# EAGLE schematic OpenModem_Schematic (EAGLE 9.2.2)
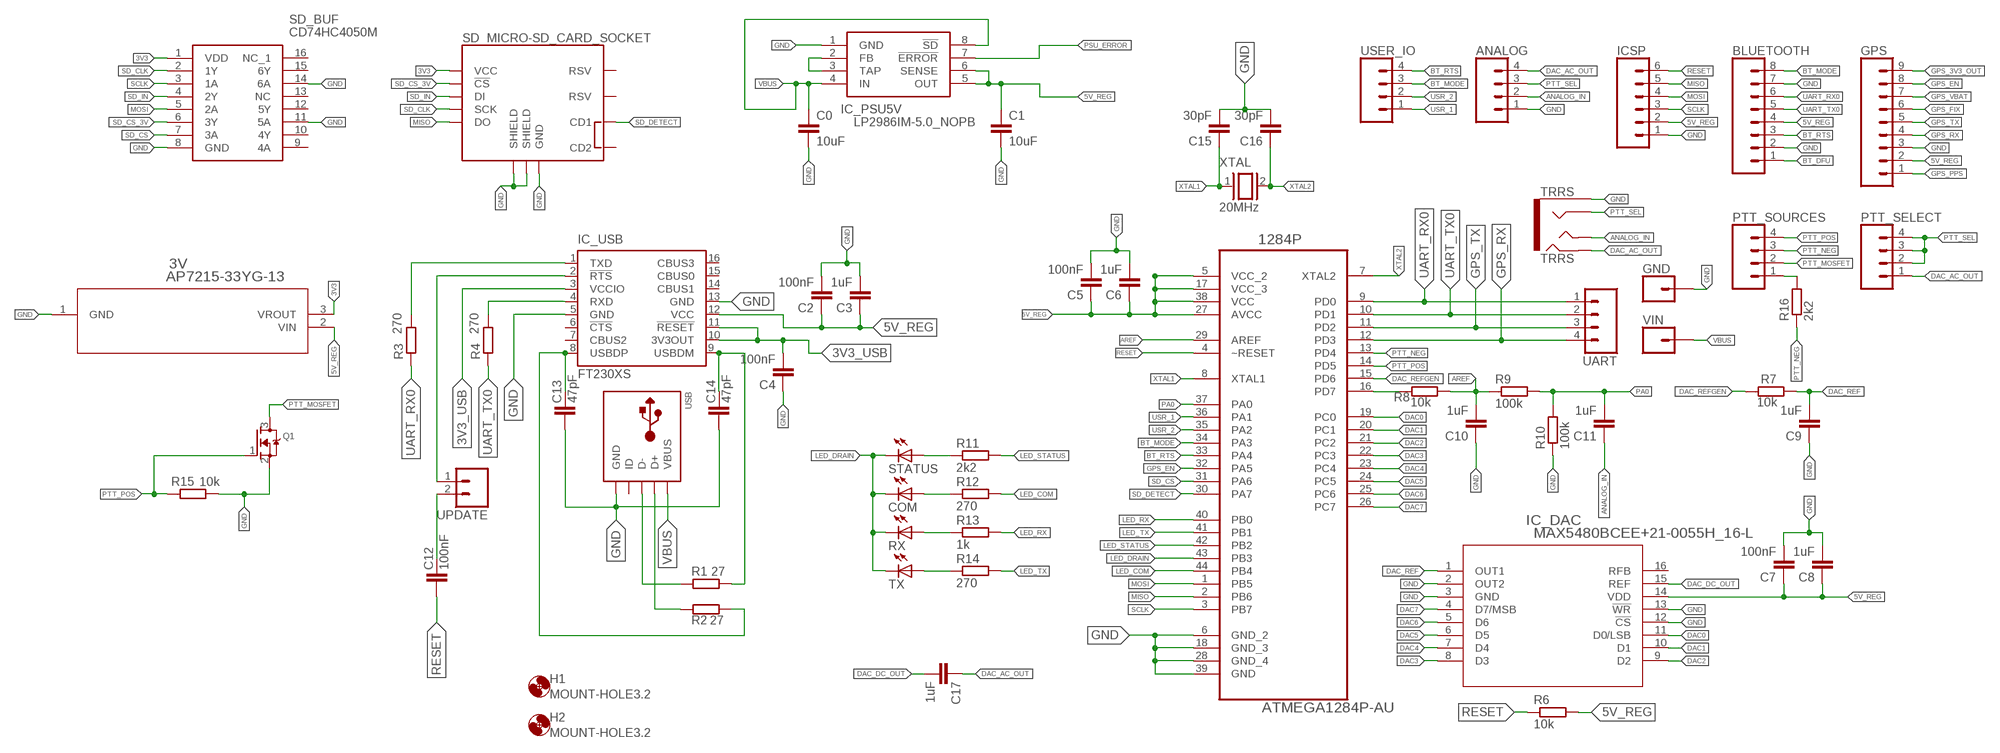
[diagram p0: schematic, sheet 1]

## Parts
3V  AP7215-33YG-13  [SOT89-3L]
1284P  ATMEGA1284P-AU  [QFP80P1200X1200X120-44N]
ANALOG  CONN_04  [1X04]
BLUETOOTH  CONN_08"  [1X08]
C0  10uF  C-EUC0805  [C0805]
C1  10uF  C-EUC0805  [C0805]
C2  100nF  C-EUC0603  [C0603]
C3  1uF  C-EUC0603  [C0603]
C4  100nF  C-EUC0603  [C0603]
C5  100nF  C-EUC0603  [C0603]
C6  1uF  C-EUC0603  [C0603]
C7  100nF  C-EUC0603  [C0603]
C8  1uF  C-EUC0603  [C0603]
C9  1uF  C-EUC0603  [C0603]
C10  1uF  C-EUC0603  [C0603]
C11  1uF  C-EUC0603  [C0603]
C12  100nF  C-EUC0603  [C0603]
C13  47pF  C-EUC0603  [C0603]
C14  47pF  C-EUC0603  [C0603]
C15  30pF  C-EUC0603  [C0603]
C16  30pF  C-EUC0603  [C0603]
C17  1uF  C-EUC0603  [C0603]
COM  LEDCHIP-LED0603  [CHIP-LED0603]
GND  CONN_01  [1X01]
GPS  CONN_09  [1X09]
H1  MOUNT-HOLE3.2  [3,2]
H2  MOUNT-HOLE3.2  [3,2]
IC_DAC  MAX5480BCEE+21-0055H_16-L  [21-0055H_16-L]
IC_PSU5V  LP2986IM-5.0_NOPB  [SOIC127P600X175-8N]
IC_USB  FT230XS  [SSOP16]
ICSP  CONN_06SILK_FEMALE_PTH  [1X06]
PTT_SELECT  CONN_04  [1X04]
PTT_SOURCES  CONN_04  [1X04]
Q1  MOSFET-NSMALLER  [SOT23-SMALLER]
R1  27  R-EU_R0603  [R0603]
R2  27  R-EU_R0603  [R0603]
R3  270  R-EU_R0603  [R0603]
R4  270  R-EU_R0603  [R0603]
R6  10k  R-EU_R0603  [R0603]
R7  10k  R-EU_R0603  [R0603]
R8  10k  R-EU_R0603  [R0603]
R9  100k  R-EU_R0603  [R0603]
R10  100k  R-EU_R0603  [R0603]
R11  2k2  R-EU_R0603  [R0603]
R12  270  R-EU_R0603  [R0603]
R13  1k  R-EU_R0603  [R0603]
R14  270  R-EU_R0603  [R0603]
R15  10k  R-EU_R0603  [R0603]
R16  2k2  R-EU_R0603  [R0603]
RX  LEDCHIP-LED0603  [CHIP-LED0603]
SD  MICRO-SD_CARD_SOCKET  [MICRO-SD-SOCKET]
SD_BUF  CD74HC4050M  [SOIC127P600X175-16N]
STATUS  LEDCHIP-LED0603  [CHIP-LED0603]
TRRS  TRRS  AUDIO_JACK_TRRSSMD_RA  [AUDIO_JACK_3.5MM_TRRS_SMD_RA]
TX  LEDCHIP-LED0603  [CHIP-LED0603]
UART  M04PTH  [1X04]
UPDATE  M02PTH  [1X02]
USB  USBMOLEX  [USB-MINIB-THM-MOLEX]
USER_IO  CONN_04  [1X04]
VIN  CONN_01  [1X01]
XTAL  20MHz  XTAL/S  [QS]

## Nets
3V3: 3V.3(VROUT) SD.VCC SD_BUF.1(VDD)
3V3_USB: C4.2 IC_USB.3(VCCIO) IC_USB.10(3V3OUT) IC_USB.11(!RESET)
5V_REG: 3V.2(VIN) 1284P.5(VCC_2) 1284P.17(VCC_3) 1284P.27(AVCC) 1284P.38(VCC) BLUETOOTH.4 C1.1 C2.1 C3.1 C5.1 C6.1 C7.1 C8.1 GPS.2 IC_DAC.14(VDD) IC_PSU5V.5(OUT) IC_PSU5V.6(SENSE) IC_USB.12(VCC) ICSP.2 R6.2
ADC_REFGEN: 1284P.16(PD7) R8.1
ANALOG_IN: ANALOG.2 C11.1 TRRS.TIP
AREF: 1284P.29(AREF) C10.2 R8.2 R9.1
BT_DFU: BLUETOOTH.1
BT_MODE: 1284P.34(PA3) BLUETOOTH.8 USER_IO.3
BT_RTS: 1284P.33(PA4) BLUETOOTH.3 USER_IO.4
DAC0: 1284P.19(PC0) IC_DAC.11(D0/LSB)
DAC1: 1284P.20(PC1) IC_DAC.10(D1)
DAC2: 1284P.21(PC2) IC_DAC.9(D2)
DAC3: 1284P.22(PC3) IC_DAC.8(D3)
DAC4: 1284P.23(PC4) IC_DAC.7(D4)
DAC5: 1284P.24(PC5) IC_DAC.6(D5)
DAC6: 1284P.25(PC6) IC_DAC.5(D6)
DAC7: 1284P.26(PC7) IC_DAC.4(D7/MSB)
DAC_AC_OUT: ANALOG.4 C17.1 PTT_SELECT.1 TRRS.RING2
DAC_DC_OUT: C17.2 IC_DAC.15(REF)
DAC_REF: C9.2 IC_DAC.1(OUT1) R7.2
DAC_REFGEN: 1284P.15(PD6) R7.1
EXT_RESET: C12.2 UPDATE.2
GND: 3V.1(GND) 1284P.6(GND_2) 1284P.18(GND_3) 1284P.28(GND_4) 1284P.39(GND) ANALOG.1 BLUETOOTH.2 BLUETOOTH.7 C0.2 C1.2 C2.2 C3.2 C4.1 C5.2 C6.2 C7.2 C8.2 C9.1 C10.1 C13.1 C14.1 C15.2 C16.2 GND.1 GPS.3 IC_DAC.2(OUT2) IC_DAC.3(GND) IC_DAC.12(!CS) IC_DAC.13(!WR) IC_PSU5V.1(GND) IC_USB.5(GND) IC_USB.13(GND) ICSP.1 Q1.2(S) R10.1 R15.1 SD.GND SD.GND1(SHIELD) SD.GND3(SHIELD) SD_BUF.8(GND) SD_BUF.11(5A) SD_BUF.14(6A) TRRS.EARTH USB.GND
GPS_3V3_OUT: GPS.9
GPS_EN: 1284P.32(PA5) GPS.8
GPS_FIX: GPS.6
GPS_PPS: GPS.1
GPS_RX: 1284P.12(PD3) GPS.4 UART.4
GPS_TX: 1284P.11(PD2) GPS.5 UART.3
GPS_VBAT: GPS.7
LED_COM: 1284P.44(PB4) R12.2
LED_DRAIN: 1284P.43(PB3) COM.C RX.C STATUS.C TX.C
LED_RX: 1284P.40(PB0) R13.2
LED_STATUS: 1284P.42(PB2) R11.2
LED_TX: 1284P.41(PB1) R14.2
MISO: 1284P.2(PB6) ICSP.5 SD.DO
MOSI: 1284P.1(PB5) ICSP.4 SD_BUF.5(2A)
N$5: R11.1 STATUS.A
N$7: COM.A R12.1
N$8: R13.1 RX.A
N$9: R14.1 TX.A
PA0: 1284P.37(PA0) C11.2 R9.2 R10.2
PSU_ERROR: IC_PSU5V.7(!ERROR)
PSU_FEEDBACK: IC_PSU5V.2(FB) IC_PSU5V.3(TAP)
PTT_MOSFET: PTT_SOURCES.2 Q1.3(D)
PTT_NEG: 1284P.13(PD4) PTT_SOURCES.3 R16.1
PTT_NEG_RES: PTT_SOURCES.1 R16.2
PTT_POS: 1284P.14(PD5) PTT_SOURCES.4 Q1.1(G) R15.2
PTT_SEL: ANALOG.3 PTT_SELECT.2 PTT_SELECT.3 PTT_SELECT.4 TRRS.RING1
RESET: 1284P.4(~RESET) C12.1 ICSP.6 R6.1
SCLK: 1284P.3(PB7) ICSP.3 SD_BUF.3(1A)
SD_CLK: SD.SCLK(SCK) SD_BUF.2(1Y)
SD_CS: 1284P.31(PA6) SD_BUF.7(3A)
SD_CS_3V: SD.CS(!CS) SD_BUF.6(3Y)
SD_DETECT: 1284P.30(PA7) SD.CD1
SD_IN: SD.DI SD_BUF.4(2Y)
UART_RX0: 1284P.9(PD0) BLUETOOTH.6 R3.1 UART.1
UART_TX0: 1284P.10(PD1) BLUETOOTH.5 R4.1 UART.2
USB_DM: C14.2 IC_USB.9(USBDM) R1.1
USB_DM_IN: R1.2 USB.D-
USB_DP: C13.2 IC_USB.8(USBDP) R2.1
USB_DP_IN: R2.2 USB.D+
USB_RTS: IC_USB.2(!RTS) UPDATE.1
USB_UART_RX: IC_USB.4(RXD) R4.2
USB_UART_TX: IC_USB.1(TXD) R3.2
USR_1: 1284P.36(PA1) USER_IO.1
USR_2: 1284P.35(PA2) USER_IO.2
VBUS: C0.1 IC_PSU5V.4(IN) IC_PSU5V.8(!SD) USB.VBUS VIN.1
XTAL1: 1284P.8(XTAL1) C15.1 XTAL.1
XTAL2: 1284P.7(XTAL2) C16.1 XTAL.2
Unconnected: IC_DAC.16(RFB) IC_USB.6(!CTS) IC_USB.7(CBUS2) IC_USB.14(CBUS1) IC_USB.15(CBUS0) IC_USB.16(CBUS3) SD.CD2 SD.RSV1(RSV) SD.RSV2(RSV) SD_BUF.9(4A) SD_BUF.10(4Y) SD_BUF.12(5Y) SD_BUF.13(NC) SD_BUF.15(6Y) SD_BUF.16(NC_1) USB.ID

## Library data of the parts
3V = AP7215-33YG:AP7215-33YG-13; MANUFACTURER_PART_NUMBER: AP721533YG13; VENDOR: Diodes Inc
1284P = Atmel_By_element14_Batch_1-00:ATMEGA1284P-AU: Microcontroller with Programmable Flash; MPN: ATMEGA1284P-AU; OC_FARNELL: 1715480; OC_NEWARK: 15R0263; PACKAGE: TQFP-44; SUPPLIER: Atmel
ANALOG PTT_SELECT PTT_SOURCES USER_IO = SparkFun-Connectors:CONN_04: Multi connection point. Often used as Generic Header-pin footprint for 0.1 inch spaced/style header connections On any of the 0.1 inch spaced packages, you can populate with these: Break Away Headers - Straight <https://www.sparkfun.com/products/116> (PRT-00116) Break Away Male Headers - Right Angle <https://www.sparkfun.com/products/553> (PRT-00553) Female Headers <https://www.sparkfun.com/products/115> (PRT-00115) Break Away Headers - Machine Pin <https://www.sparkfun.com/products/117> (PRT-00117) Break Away Female Headers - Swiss Machine Pin <https://www.sparkfun.com/products/743> (PRT-00743) For SCREWTERMINALS and SPRING TERMINALS visit here: Screw Terimnals on SparkFun.com <https://www.sparkfun.com/search/results?term=Screw+Terminals> (5mm/3.5mm/2.54mm spacing) This device is also useful as a general connection point to wire up your design to another part of your project. Our various solder wires solder well into these plated through hole pads. Hook-Up Wire - Assortment (Stranded, 22 AWG) <https://www.sparkfun.com/products/11375> (PRT-11375) Hook-Up Wire - Assortment (Solid Core, 22 AWG) <https://www.sparkfun.com/products/11367> (PRT-11367) View the entire wire category on our website here <https://www.sparkfun.com/categories/141> Special notes: Molex polarized connector foot print use with SKU : PRT-08231 with associated crimp pins and housings. 1MM SMD Version SKU: PRT-10208; PROD_ID: CONN-09696
BLUETOOTH = SparkFun-Connectors:CONN_08: Multi connection point. Often used as Generic Header-pin footprint for 0.1 inch spaced/style header connections On any of the 0.1 inch spaced packages, you can populate with these: Break Away Headers - Straight <https://www.sparkfun.com/products/116> (PRT-00116) Break Away Male Headers - Right Angle <https://www.sparkfun.com/products/553> (PRT-00553) Female Headers <https://www.sparkfun.com/products/115> (PRT-00115) Break Away Headers - Machine Pin <https://www.sparkfun.com/products/117> (PRT-00117) Break Away Female Headers - Swiss Machine Pin <https://www.sparkfun.com/products/743> (PRT-00743) Arduino Stackable Header - 8 Pin <https://www.sparkfun.com/products/9279> (PRT-09279) For SCREWTERMINALS and SPRING TERMINALS visit here: Screw Terimnals on SparkFun.com <https://www.sparkfun.com/search/results?term=Screw+Terminals> (5mm/3.5mm/2.54mm spacing) This device is also useful as a general connection point to wire up your design to another part of your project. Our various solder wires solder well into these plated through hole pads. Hook-Up Wire - Assortment (Stranded, 22 AWG) <https://www.sparkfun.com/products/11375> (PRT-11375) Hook-Up Wire - Assortment (Solid Core, 22 AWG) <https://www.sparkfun.com/products/11367> (PRT-11367) View the entire wire category on our website here <https://www.sparkfun.com/categories/141> Special notes: Molex polarized connector foot print use with SKU : PRT-08231 with associated crimp pins and housings. 1MM SMD Version SKU: PRT-10208 NOTES ON THE VARIANTS LOCK and LOCK_LONGPADS... This footprint was designed to help hold the alignment of a through-hole component (i.e. 6-pin header) while soldering it into place. You may notice that each hole has been shifted either up or down by 0.005 of an inch from it's more standard position (which is a perfectly straight line). This slight alteration caused the pins (the squares in the middle) to touch the edges of the holes. Because they are alternating, it causes a "brace" to hold the component in place. 0.005 has proven to be the perfect amount of "off-center" position when using our standard breakaway headers. Although looks a little odd when you look at the bare footprint, once you have a header in there, the alteration is very hard to notice. Also,if you push a header all the way into place, it is covered up entirely on the bottom side.; PROD_ID: CONN-08438
C0 C1-C17 = rcl:C-EU: CAPACITOR, European symbol
COM RX STATUS TX = adafruit:LED: LED OSRAM: - CHIPLED LG R971, LG N971, LY N971, LG Q971, LY Q971, LO R971, LY R971 LH N974, LH R974 LS Q976, LO Q976, LY Q976 LO Q996 - Hyper CHIPLED LW Q18S LB Q993, LB Q99A, LB R99A - SideLED LS A670, LO A670, LY A670, LG A670, LP A670 LB A673, LV A673, LT A673, LW A673 LH A674 LY A675 LS A676, LA A676, LO A676, LY A676, LW A676 LS A679, LY A679, LG A679 - Hyper Micro SIDELED® LS Y876, LA Y876, LO Y876, LY Y876 LT Y87S - SmartLED LW L88C, LW L88S LB L89C, LB L89S, LG L890 LS L89K, LO L89K, LY L89K LS L896, LA L896, LO L896, LY L896 - TOPLED LS T670, LO T670, LY T670, LG T670, LP T670 LSG T670, LSP T670, LSY T670, LOP T670, LYG T670 LG T671, LOG T671, LSG T671 LB T673, LV T673, LT T673, LW T673 LH T674 LS T676, LA T676, LO T676, LY T676, LB T676, LH T676, LSB T676, LW T676 LB T67C, LV T67C, LT T67C, LS T67K, LO T67K, LY T67K, LW E67C LS E67B, LA E67B, LO E67B, LY E67B, LB E67C, LV E67C, LT E67C LW T67C LS T679, LY T679, LG T679 LS T770, LO T770, LY T770, LG T770, LP T770 LB T773, LV T773, LT T773, LW T773 LH T774 LS E675, LA E675, LY E675, LS T675 LS T776, LA T776, LO T776, LY T776, LB T776 LHGB T686 LT T68C, LB T68C - Hyper Mini TOPLED® LB M676 - Mini TOPLED Santana® LG M470 LS M47K, LO M47K, LY M47K Source: http://www.osram.convergy.de/
GND VIN = SparkFun-Connectors:CONN_01: Single connection point. Often used as Generic Header-pin footprint for 0.1 inch spaced/style header connections On any of the 0.1 inch spaced packages, you can populate with these: Break Away Headers - Straight <https://www.sparkfun.com/products/116> (PRT-00116) Break Away Male Headers - Right Angle <https://www.sparkfun.com/products/553> (PRT-00553) Female Headers <https://www.sparkfun.com/products/115> (PRT-00115) Break Away Headers - Machine Pin <https://www.sparkfun.com/products/117> (PRT-00117) Break Away Female Headers - Swiss Machine Pin <https://www.sparkfun.com/products/743> (PRT-00743) This device is also useful as a general connection point to wire up your design to another part of your project. Our various solder wires solder well into these plated through hole pads. Hook-Up Wire - Assortment (Stranded, 22 AWG) <https://www.sparkfun.com/products/11375> (PRT-11375) Hook-Up Wire - Assortment (Solid Core, 22 AWG) <https://www.sparkfun.com/products/11367> (PRT-11367) View the entire wire category on our website here <https://www.sparkfun.com/categories/141> Special notes: SMTSO-256-ET is a "flush mount" nut for a 4-40 screw. We mostly use this on specialty testbeds; it is a nice way to connect hardware to your PCB at an adjustable hieght. Also note, the SNAP packages are for using a snappable style connector. We sell a baggie of snaps and they are also used on two LilyPad designs: Snap Assortment - 30 pack (male and female) <https://www.sparkfun.com/products/11347> (DEV-11347) LilyPad Arduino SimpleSnap <https://www.sparkfun.com/products/10941> (DEV-10941) LilyPad SimpleSnap Protoboard <https://www.sparkfun.com/products/10940> (DEV-10940)
GPS = SparkFun-Connectors:CONN_09: Multi connection point. Often used as Generic Header-pin footprint for 0.1 inch spaced/style header connections On any of the 0.1 inch spaced packages, you can populate with these: Break Away Headers - Straight <https://www.sparkfun.com/products/116> (PRT-00116) Break Away Male Headers - Right Angle <https://www.sparkfun.com/products/553> (PRT-00553) Female Headers <https://www.sparkfun.com/products/115> (PRT-00115) Break Away Headers - Machine Pin <https://www.sparkfun.com/products/117> (PRT-00117) Break Away Female Headers - Swiss Machine Pin <https://www.sparkfun.com/products/743> (PRT-00743) For SCREWTERMINALS and SPRING TERMINALS visit here: Screw Terimnals on SparkFun.com <https://www.sparkfun.com/search/results?term=Screw+Terminals> (5mm/3.5mm/2.54mm spacing) This device is also useful as a general connection point to wire up your design to another part of your project. Our various solder wires solder well into these plated through hole pads. Hook-Up Wire - Assortment (Stranded, 22 AWG) <https://www.sparkfun.com/products/11375> (PRT-11375) Hook-Up Wire - Assortment (Solid Core, 22 AWG) <https://www.sparkfun.com/products/11367> (PRT-11367) View the entire wire category on our website here <https://www.sparkfun.com/categories/141> Special notes: Molex polarized connector foot print use with SKU : PRT-08231 with associated crimp pins and housings. 1MM SMD Version SKU: PRT-10208 NOTES ON THE VARIANTS LOCK and LOCK_LONGPADS... This footprint was designed to help hold the alignment of a through-hole component (i.e. 6-pin header) while soldering it into place. You may notice that each hole has been shifted either up or down by 0.005 of an inch from it's more standard position (which is a perfectly straight line). This slight alteration caused the pins (the squares in the middle) to touch the edges of the holes. Because they are alternating, it causes a "brace" to hold the component in place. 0.005 has proven to be the perfect amount of "off-center" position when using our standard breakaway headers. Although looks a little odd when you look at the bare footprint, once you have a header in there, the alteration is very hard to notice. Also,if you push a header all the way into place, it is covered up entirely on the bottom side.
H1 H2 = holes:MOUNT-HOLE: MOUNTING HOLE with drill center marker
IC_DAC = MAX5480:MAX5480BCEE+; MANUFACTURER_PART_NUMBER: MAX5480BCEE+; VENDOR: Maxim Integrated Products
IC_PSU5V = SamacSys_Parts:LP2986IM-5.0_NOPB: Micropower, 200 mA Ultra Low-Dropout Fixed or Adjustable Voltage Regulator Source: Datasheet <http://www.ti.com/lit/ds/symlink/lp2986.pdf>; DESCRIPTION: Micropower, 200 mA Ultra Low-Dropout Fixed or Adjustable Voltage Regulator; HEIGHT: 1.75mm; MANUFACTURER_NAME: Texas Instruments; MANUFACTURER_PART_NUMBER: LP2986IM-5.0/NOPB; MOUSER_PART_NUMBER: 926-2986IM-5.0/NOPB
IC_USB = ftdichip:FT230X: USB to BASIC UART IC Auto generated by make-symbol-device-package-bsdl.ulp Rev. 43 Source: Data sheet <http://www.ftdichip.com/Support/Documents/DataSheets/ICs/DS_FT230X.pdf>
ICSP = SparkFun-Connectors:CONN_06: Multi connection point. Often used as Generic Header-pin footprint for 0.1 inch spaced/style header connections On any of the 0.1 inch spaced packages, you can populate with these: Break Away Headers - Straight <https://www.sparkfun.com/products/116> (PRT-00116) Break Away Male Headers - Right Angle <https://www.sparkfun.com/products/553> (PRT-00553) Female Headers <https://www.sparkfun.com/products/115> (PRT-00115) Break Away Headers - Machine Pin <https://www.sparkfun.com/products/117> (PRT-00117) Break Away Female Headers - Swiss Machine Pin <https://www.sparkfun.com/products/743> (PRT-00743) Arduino Stackable Header - 6 Pin <https://www.sparkfun.com/products/9280> (PRT-09280) For SCREWTERMINALS and SPRING TERMINALS visit here: Screw Terimnals on SparkFun.com <https://www.sparkfun.com/search/results?term=Screw+Terminals> (5mm/3.5mm/2.54mm spacing) This device is also useful as a general connection point to wire up your design to another part of your project. Our various solder wires solder well into these plated through hole pads. Hook-Up Wire - Assortment (Stranded, 22 AWG) <https://www.sparkfun.com/products/11375> (PRT-11375) Hook-Up Wire - Assortment (Solid Core, 22 AWG) <https://www.sparkfun.com/products/11367> (PRT-11367) View the entire wire category on our website here <https://www.sparkfun.com/categories/141>; PROD_ID: CONN-08437
Q1 = Adafruit_Custom_SOT23:MOSFET-N: N-Channel Mosfet 2N7002E - 60V 260mA SOT23 [Digikey: 2N7002ET1GOSTR-ND] - REEL BSH103 - 30V 850mA SOT23 [Digikey: 568-5013-1-ND]
R1-R4 R6-R16 = rcl:R-EU_: RESISTOR, European symbol
SD = SparkFun-Connectors:MICRO-SD_CARD_SOCKET: microSD Socket for Transflash Push-push type µSD socket. tDoc lines correctly indicate media card edge positions when inserting (unlocked, locked, depressed). NOTE: CD1 and CD2 are connected internally, and the default detect state of the socket is detect pin to ground. SparkFun Products: WAV Trigger <https://www.sparkfun.com/products/13660> CAN-Bus Shield <https://www.sparkfun.com/products/13262> SparkFun Level Shifing microSD Breakout <https://www.sparkfun.com/products/13743>; PROD_ID: CONN-07820; SF_ID: PRT-00127
SD_BUF = Buffer:CD74HC4050M: CD74HC4050MG4, Hex Buffer, Converter, HC, Non-Inverting 2 to 6V 16-Pin SOIC Source: Datasheet <http://www.ti.com/lit/ds/symlink/cd74hc4050.pdf>; DESCRIPTION: CD74HC4050MG4, Hex Buffer, Converter, HC, Non-Inverting 2 to 6V 16-Pin SOIC; HEIGHT: 1.75mm; MANUFACTURER_NAME: Texas Instruments; MANUFACTURER_PART_NUMBER: CD74HC4050M; MOUSER_PART_NUMBER: 595-CD74HC4050M
TRRS = SparkFun-Connectors:AUDIO_JACK_TRRS: Audio Jack - 3.5mm TRRS (SMD) This is a 3.5mm TRRS SMD audio jack. TRRS connectors are the audio-style connectors that you see on some phones, MP3 players and development boards. TRRS stands for “tip, ring, ring, sleeve,” which reflects that this has three conductors and a ground. SparkFun Products: Audio Jack <https://www.sparkfun.com/products/12639> mbed Starter Kit <https://www.sparkfun.com/products/12968> SparkFun TRRS 3.5mm Jack Breakout <https://www.sparkfun.com/products/11570>; PROD_ID: CONN-10676; SF_ID: PRT-12639
UART = SparkFun-Connectors:M04: Header 4 Standard 4-pin 0.1" header. Use with straight break away headers (SKU : PRT-00116), right angle break away headers (PRT-00553), swiss pins (PRT-00743), machine pins (PRT-00117), and female headers (PRT-00115). Molex polarized connector foot print use with SKU : PRT-08231 with associated crimp pins and housings. 1MM SMD Version SKU: PRT-10208
UPDATE = SparkFun-Connectors:M02: Standard 2-pin 0.1" header. Use with - straight break away headers ( PRT-00116) - right angle break away headers (PRT-00553) - swiss pins (PRT-00743) - machine pins (PRT-00117) - female headers (PRT-00115) Molex polarized connector foot print use with: PRT-08233 with associated crimp pins and housings. 2.54_SCREWTERM for use with PRT-10571. 3.5mm Screw Terminal footprints for PRT-08084 5mm Screw Terminal footprints for use with PRT-08432
USB = adafruit:USB: USB Connectors USBMINIB - Surface Mount Female Mini-B USB Connector 4UConnector: 06564 By microbuilder.eu Thru-hole RA Female Mini-B USB Connector 4UConnector: 18732 By ladyada.net
XTAL = special:XTAL/S: CRYSTAL